# EAGLE design damper (EAGLE 7.6.0)
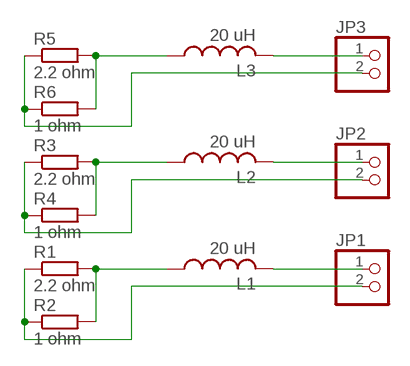
[diagram p0: schematic, sheet 1]

## Parts
JP1  PINHD-1X2  [1X02]
JP2  PINHD-1X2  [1X02]
JP3  PINHD-1X2  [1X02]
L1  20 uH  L-US0207/10  [0207/10]
L2  20 uH  L-US0207/10  [0207/10]
L3  20 uH  L-US0207/10  [0207/10]
R1  2.2 ohm  R-EU_VTA52  [VTA52]
R2  1 ohm  R-EU_VTA52  [VTA52]
R3  2.2 ohm  R-EU_VTA52  [VTA52]
R4  1 ohm  R-EU_VTA52  [VTA52]
R5  2.2 ohm  R-EU_VTA52  [VTA52]
R6  1 ohm  R-EU_VTA52  [VTA52]

## Nets
N$1: L1.1 R1.2 R2.2
N$2: JP1.1 L1.2
N$3: JP1.2 R1.1 R2.1
N$4: L2.1 R3.2 R4.2
N$5: JP2.1 L2.2
N$6: JP2.2 R3.1 R4.1
N$7: L3.1 R5.2 R6.2
N$8: JP3.1 L3.2
N$9: JP3.2 R5.1 R6.1

## Library data of the parts
JP1-JP3 = pinhead:PINHD-1X2: PIN HEADER
L1-L3 = rcl:L-US: INDUCTOR, American symbol
R1-R6 = rcl:R-EU_: RESISTOR, European symbol

## Net classes
0 default: width 1.524 mm, clearance 0.381 mm

## Board
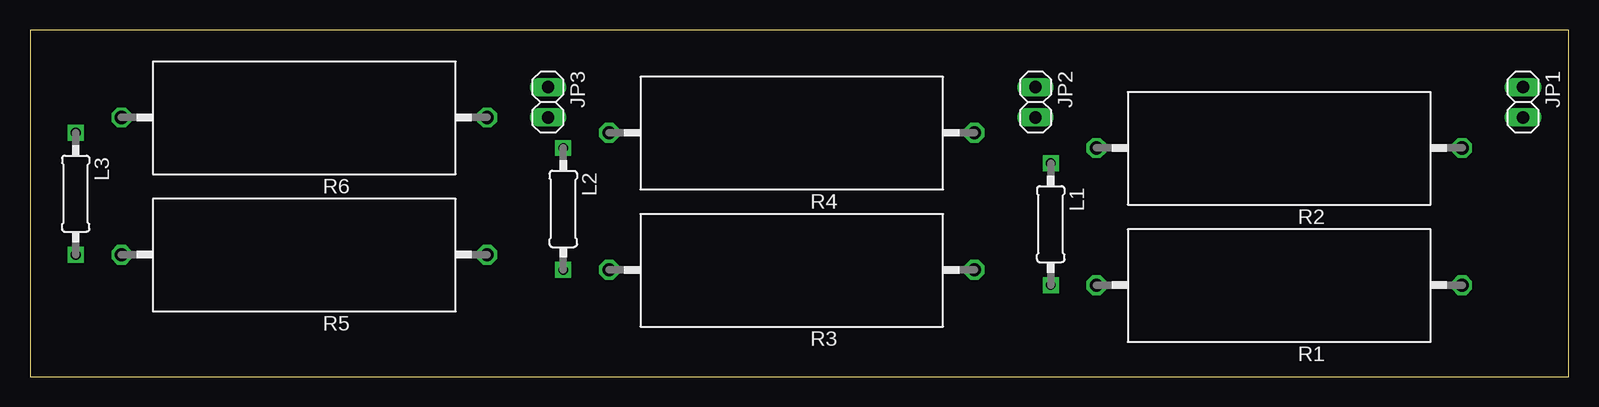
[diagram p1: board, top side]
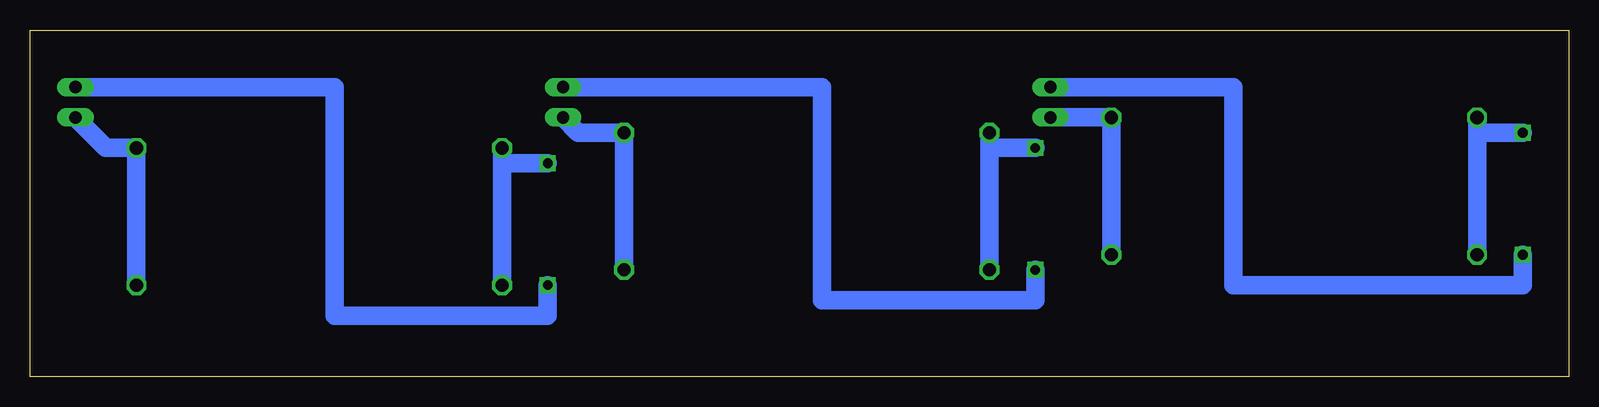
[diagram p2: board, bottom side, seen from below]

Size 128.25 x 28.88 mm. Coordinates in mm from the lower left corner, seen from the top.
Outline: 0,0 128.25,0 128.25,28.88 0,28.88 0,0
Copper layers (1*16): Top 0.035mm / dielectric 1.5mm / Bottom 0.035mm
Design rules "default": minimum track width 10mil, minimum drill 24mil, track to track 8mil, track to pad 8mil, pad to pad 8mil, via to via 8mil, smd to smd 8mil, copper to edge 40mil, drill to drill 8mil, minimum pad ring 10mil, minimum via ring 8mil, stop-mask expansion 4mil, vias tented up to drill 0mil, thermal gap 10mil

### Footprints (pad centres in the part's own frame; a part is rotated, then mirrored left to right if it is on the bottom)
1X02 = drill 1.016 long: 1 -1.27,0; 2 1.27,0
0207/10 = drill 0.813 square: 1 -5.08,0; 2 5.08,0
VTA52 = drill 1.1 octagon: 1 -15.24,0; 2 15.24,0

### Placement (x,y rotation side)
JP1  124.46,22.86 270 top
JP2  83.82,22.86 270 top
JP3  43.18,22.86 270 top
L1  85.09,12.7 270 top
L2  44.45,13.97 270 top
L3  3.81,15.24 270 top
R1  104.14,7.62 180 top
R2  104.14,19.05 180 top
R3  63.5,8.89 180 top
R4  63.5,20.32 180 top
R5  22.86,10.16 180 top
R6  22.86,21.59 180 top

### Tracks (layer width: path | path; a pad name or v marks a point on that pad's centre or on a via)
N$1
  Bottom 1.524: 88.9,17.78 L1.1 | R2.2 88.9,17.78 | 88.9,17.78 R1.2
N$2
  Bottom 1.524: L1.2 85.09,5.08 102.87,5.08 102.87,24.13 JP1.1
N$3
  Bottom 1.524: R1.1 R2.1 121.92,19.05 JP1.2
N$4
  Bottom 1.524: 48.26,19.05 L2.1 | R4.2 48.26,19.05 | 48.26,19.05 R3.2
N$5
  Bottom 1.524: L2.2 44.45,6.35 62.23,6.35 62.23,24.13 JP2.1
N$6
  Bottom 1.524: R3.1 R4.1 82.55,20.32 JP2.2
N$7
  Bottom 1.524: 7.62,20.32 L3.1 | R6.2 7.62,20.32 | 7.62,20.32 R5.2
N$8
  Bottom 1.524: L3.2 3.81,7.62 27.94,7.62 27.94,24.13 JP3.1
N$9
  Bottom 1.524: JP3.2 R6.1 R5.1